# Altium schematic sheet S7CAS-PLEIADES-CARTE-MERE_TO_BE_DELETED.SchDoc
size Tabloid; SheetNumber: 18; SheetTotal: 18; Size: 11x17; Sheet_Name: Sheet Description
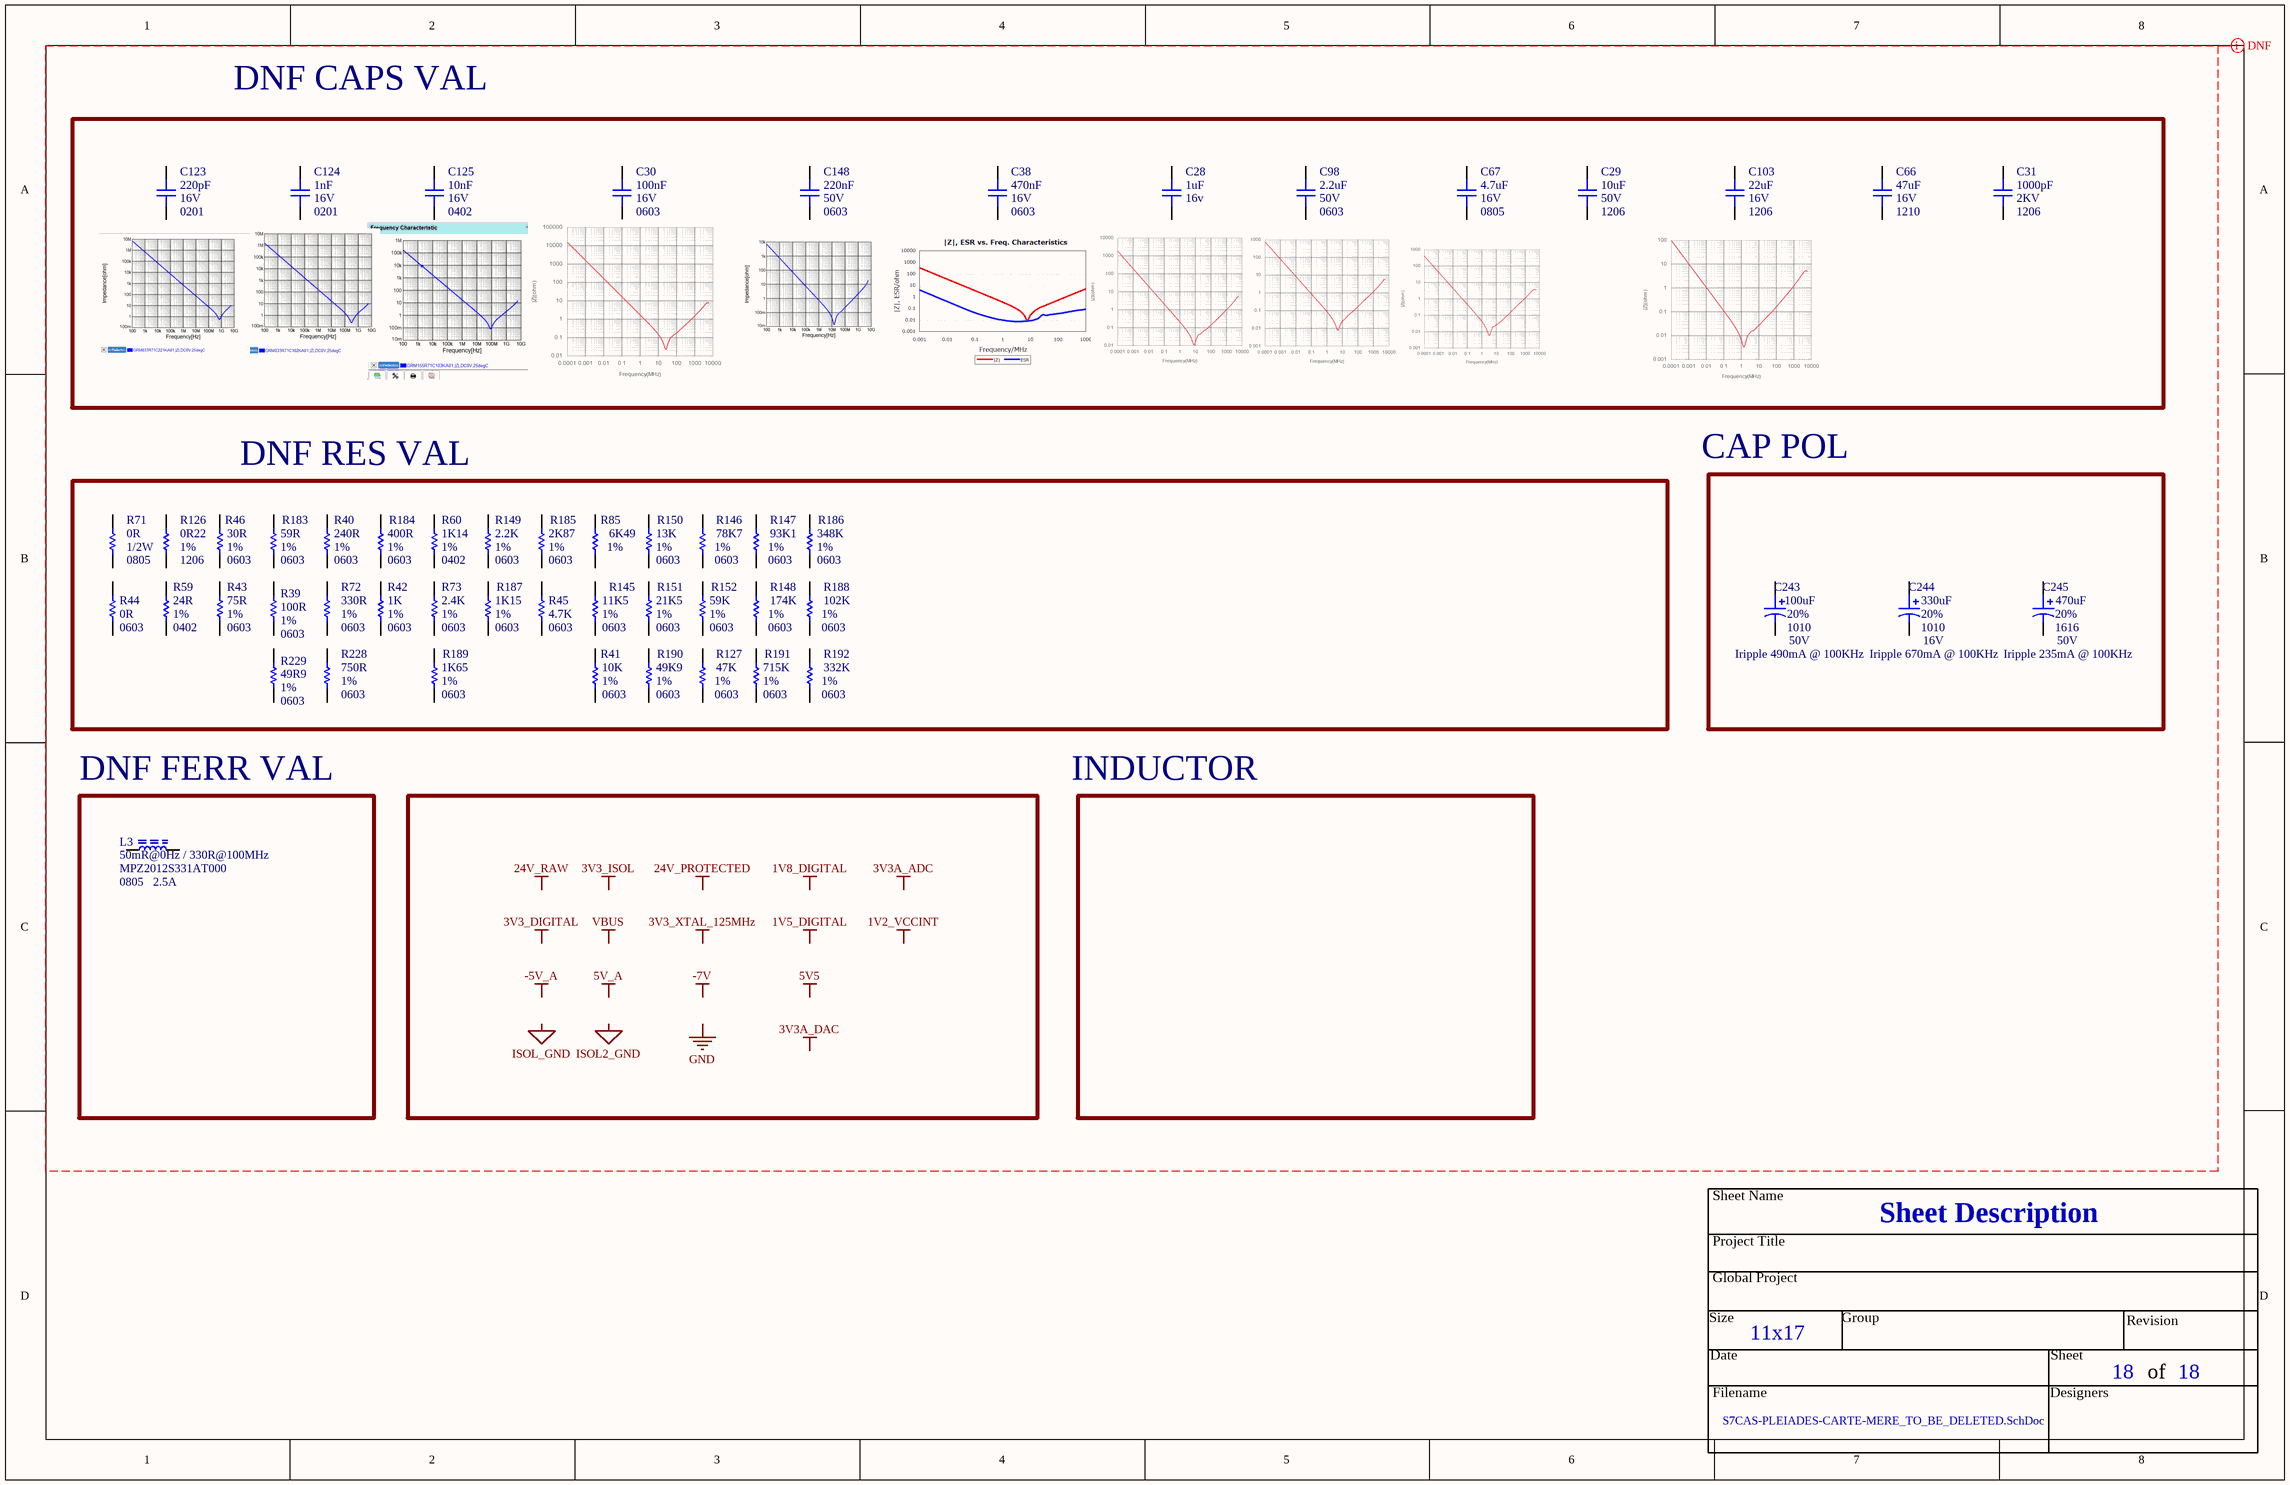
[diagram p0: S7CAS-PLEIADES-CARTE-MERE_TO_BE_DELETED.SchDoc]

## Parts
C28  value 1uF  Voltage: 16v  [CAP_0603]  (hidden comment: CAP - 0603)
C29  value 10uF  Voltage: 50V  Package: 1206  [CAP_1206]  (hidden comment: CAP - 1206)
C30  value 100nF  Voltage: 16V  Package: 0603  [CAP_0603]  (hidden comment: CAP - 0603)
C31  value 1000pF  Voltage: 2KV  Package: 1206  [CAP_1206]  (hidden comment: CAP - 1206)
C38  value 470nF  Voltage: 16V  Package: 0603  [CAP_0603]  (hidden comment: CAP - 0603)
C66  value 47uF  Voltage: 16V  Package: 1210  [CAP_1210]  (hidden comment: CAP - 1210)
C67  value 4.7uF  Voltage: 16V  Package: 0805  [CAP_0805]  (hidden comment: CAP - 0805)
C98  value 2.2uF  Voltage: 50V  Package: 0603  [CAP_0603]  (hidden comment: CAP - 0603)
C103  value 22uF  Voltage: 16V  Package: 1206  [CAP_1206]  (hidden comment: CAP - 1206)
C123  value 220pF  Voltage: 16V  Package: 0201  [CAP_0201]  (hidden comment: CAP - 0201)
C124  value 1nF  Voltage: 16V  Package: 0201  [CAP_0201]  (hidden comment: CAP - 0201)
C125  value 10nF  Voltage: 16V  Package: 0402  [CAP_0402]  (hidden comment: CAP - 0402)
C148  value 220nF  Voltage: 50V  Package: 0603  [CAP_0603]  (hidden comment: CAP - 0603)
C243  value 100uF  Voltage: 50V  Package: 1010  Precision: 20%  [CAP_ALU_1010_vishay]  (hidden comment: MAL215099101E3)
C244  value 330uF  Voltage: 16V  Package: 1010  Precision: 20%  [CAP_ALU_1010_vishay]  (hidden comment: MAL214699501E3)
C245  value 470uF  Voltage: 50V  Package: 1616  Precision: 20%  [CAP_ALU_1616_vishay]  (hidden comment: MAL214699108E3)
L3  value 50mR@0Hz / 330R@100MHz  Mfg Part Number: MPZ2012S331AT000  Current: 2.5A  Package: 0805  [FER_0805]  (hidden comment: FER - 0805)
R39  value 100R  Package: 0603  Precision: 1%  [RES_0603]  (hidden comment: RES - 0603)
R40  value 240R  Package: 0603  Precision: 1%  [RES_0603]  (hidden comment: RES - 0603)
R41  value 10K  Package: 0603  Precision: 1%  [RES_0603]  (hidden comment: RES - 0603)
R42  value 1K  Package: 0603  Precision: 1%  [RES_0603]  (hidden comment: RES - 0603)
R43  value 75R  Package: 0603  Precision: 1%  [RES_0603]  (hidden comment: RES - 0603)
R44  value 0R  Package: 0603  [RES_0603]  (hidden comment: RES - 0603)
R45  value 4.7K  Package: 0603  [RES_0603]  (hidden comment: RES - 0603)
R46  value 30R  Package: 0603  Precision: 1%  [RES_0603]  (hidden comment: RES - 0603)
R59  value 24R  Package: 0402  Precision: 1%  [RES_0402]  (hidden comment: RES - 0402)
R60  value 1K14  Package: 0402  Precision: 1%  [RES_0402]  (hidden comment: RES - 0402)
R71  value 0R  Power: 1/2W  Package: 0805  [RES_0805]  (hidden comment: RES - 0805)
R72  value 330R  Package: 0603  Precision: 1%  [RES_0603]  (hidden comment: RES - 0603)
R73  value 2.4K  Package: 0603  Precision: 1%  [RES_0603]  (hidden comment: RES - 0603)
R85  value 6K49  Precision: 1%  [RES_0402]  (hidden comment: RES - 0402)
R126  value 0R22  Package: 1206  Precision: 1%  [RES_1206]  (hidden comment: RES - 1206)
R127  value 47K  Package: 0603  Precision: 1%  [RES_0603]  (hidden comment: RES - 0603)
R145  value 11K5  Package: 0603  Precision: 1%  [RES_0603]  (hidden comment: RES - 0603)
R146  value 78K7  Package: 0603  Precision: 1%  [RES_0603]  (hidden comment: RES - 0603)
R147  value 93K1  Package: 0603  Precision: 1%  [RES_0603]  (hidden comment: RES - 0603)
R148  value 174K  Package: 0603  Precision: 1%  [RES_0603]  (hidden comment: RES - 0603)
R149  value 2.2K  Package: 0603  Precision: 1%  [RES_0603]  (hidden comment: RES - 0603)
R150  value 13K  Package: 0603  Precision: 1%  [RES_0603]  (hidden comment: RES - 0603)
R151  value 21K5  Package: 0603  Precision: 1%  [RES_0603]  (hidden comment: RES - 0603)
R152  value 59K  Package: 0603  Precision: 1%  [RES_0603]  (hidden comment: RES - 0603)
R183  value 59R  Package: 0603  Precision: 1%  [RES_0603]  (hidden comment: RES - 0603)
R184  value 400R  Package: 0603  Precision: 1%  [RES_0603]  (hidden comment: RES - 0603)
R185  value 2K87  Package: 0603  Precision: 1%  [RES_0603]  (hidden comment: RES - 0603)
R186  value 348K  Package: 0603  Precision: 1%  [RES_0603]  (hidden comment: RES - 0603)
R187  value 1K15  Package: 0603  Precision: 1%  [RES_0603]  (hidden comment: RES - 0603)
R188  value 102K  Package: 0603  Precision: 1%  [RES_0603]  (hidden comment: RES - 0603)
R189  value 1K65  Package: 0603  Precision: 1%  [RES_0603]  (hidden comment: RES - 0603)
R190  value 49K9  Package: 0603  Precision: 1%  [RES_0603]  (hidden comment: RES - 0603)
R191  value 715K  Package: 0603  Precision: 1%  [RES_0603]  (hidden comment: RES - 0603)
R192  value 332K  Package: 0603  Precision: 1%  [RES_0603]  (hidden comment: RES - 0603)
R228  value 750R  Package: 0603  Precision: 1%  [RES_0603]  (hidden comment: RES - 0603)
R229  value 49R9  Package: 0603  Precision: 1%  [RES_0603]  (hidden comment: RES - 0603)

## Blocks framed on the sheet
DNF RES VAL: R39-R46 R59 R60 R71-R73 R85 R126 R127 R145-R152 R183-R192 R228 R229
DNF FERR VAL: L3

## Nets

Not connected (* = marked no-connect by the designer): C28 1 2; C29 1 2; C30 1 2; C31 1 2; C38 1 2; C66 1 2; C67 1 2; C98 1 2; C103 1 2; C123 1 2; C124 1 2; C125 1 2; C148 1 2; C243 1 2; C244 1 2; C245 1 2; L3 1 2; R39 1 2; R40 1 2; R41 1 2; R42 1 2; R43 1 2; R44 1 2; R45 1 2; R46 1 2; R59 1 2; R60 1 2; R71 1 2; R72 1 2; R73 1 2; R85 1 2; R126 1 2; R127 1 2; R145 1 2; R146 1 2; R147 1 2; R148 1 2; R149 1 2; R150 1 2; R151 1 2; R152 1 2; R183 1 2; R184 1 2; R185 1 2; R186 1 2; R187 1 2; R188 1 2; R189 1 2; R190 1 2; R191 1 2; R192 1 2; R228 1 2; R229 1 2

## Layout directives
CompClassName: DNF_CLASS_COMPONENT: 1V2_VCCINT, 1V5_DIGITAL, 1V8_DIGITAL, 3V3_DIGITAL, 3V3_ISOL, 3V3_XTAL_125MHz, 3V3A_ADC, 3V3A_DAC, 5V5, 5V_A, 24V_PROTECTED, 24V_RAW, -5V_A, -7V, GND, ISOL2_GND, ISOL_GND, VBUS

## Notes on the sheet
- DNF CAPS VAL
- CAP POL
- (near C243) Iripple 490mA @ 100KHz
- (near C244) Iripple 670mA @ 100KHz
- (near C245) Iripple 235mA @ 100KHz
- INDUCTOR
- Labels drawn without touching a wire or pin: 1V2_VCCINT, 1V5_DIGITAL, 1V8_DIGITAL, 3V3_DIGITAL, 3V3_ISOL, 3V3_XTAL_125MHz, 3V3A_ADC, 3V3A_DAC, 5V5, 5V_A, 24V_PROTECTED, 24V_RAW, -5V_A, -7V, GND, ISOL2_GND, ISOL_GND, VBUS
- Sheet Name
- Project Title
- Global Project
- Revision
- Size
- Date
- Group
- Sheet
- of
- Filename
- Designers

## Library data of the parts
C28 C30 C38 C98 C148 = CAP - 0603: Precision: 10%; Current: *; CreatedBy: Jonathan Bouchard; Power: *; Supplier 1: Arrow Electronics
  C28: Package: 0603; Supplier Part Number 1: CL10B105MO8NNWC
  C30: Supplier Part Number 1: CL10B104KO8NNNC
  C38: Supplier Part Number 1: C1608X7R1C474K080AC
  C98: Supplier Part Number 1: GRM188R61H225KE11D
  C148: Supplier Part Number 1: GRM188R71H224KAC4D
C29 C31 C103 = CAP - 1206: Precision: 10%; Current: *; CreatedBy: Jonathan Bouchard; Power: *
  C29: Supplier 1: Avnet; Supplier Part Number 1: CL31A106MBHNNNE
  C31: Supplier 1: Arrow Electronics; Supplier Part Number 1: 1206GC102KAT1A
  C103: Supplier 1: Arrow Electronics; Supplier Part Number 1: CL31A226MOCLNNC
C66 = CAP - 1210: Precision: 10%; Current: *; CreatedBy: Jonathan Bouchard; Power: *; Supplier 1: Arrow Electronics; Supplier Part Number 1: CL32A476KOJNNNE
C67 = CAP - 0805: Precision: 10%; Current: *; CreatedBy: Jonathan Bouchard; Power: *; Supplier 1: Arrow Electronics; Supplier Part Number 1: CL21B475KOFNFNE
C123 C124 = CAP - 0201: Precision: 10%; Current: *; CreatedBy: Jonathan Bouchard; Power: *
  C123: Supplier 1: Arrow Electronics; Supplier Part Number 1: GRM033R71C221KA01D
  C124: Supplier 1: Avnet; Supplier Part Number 1: GRM033R71C102KA01J
C125 = CAP - 0402: Precision: 10%; Current: *; CreatedBy: Jonathan Bouchard; Power: *; Supplier 1: Arrow Electronics; Supplier Part Number 1: GRM155R61A224KE19D
C243 = CAP_ALU_MAL215099101E3: CAP - ALU 100uF 20% 50V - 1010; Current: 490mA; Mfg: Vishay Dale; Mfg Part Number: MAL215099101E3; HelpURL: http://www.vishay.com/docs/28395/150crz.pdf; CreatedBy: Jonathan Bouchard; Temperature: -55°C to 125°C; Power: *; Supplier 1: Digikey; Supplier Part Number 1: 4399PHDKR-ND
C244 = CAP_ALU_MAL214699501E3: CAP - ALU 330uF 20% 16V - 1010; Current: 750mA; Mfg: Vishay Dale; Mfg Part Number: MAL214699501E3; HelpURL: http://www.vishay.com/docs/28403/146cti.pdf; CreatedBy: Jonathan Bouchard; Temperature: -55°C to 125°C; Power: *; Supplier 1: Digikey; Supplier Part Number 1: 4405PHCT-ND
C245 = CAP_ALU_MAL214699108E3: CAP - ALU 470uF 20% 50V - 1616; Current: 1.3A; Mfg: Vishay Dale; Mfg Part Number: MAL214699108E3; HelpURL: http://www.vishay.com/docs/28403/146cti.pdf; CreatedBy: Jonathan Bouchard; Temperature: -55°C to 125°C; Power: *; Supplier 1: Digikey; Supplier Part Number 1: 4442PHCT-ND
L3 = FER - 0805: Mfg: TDK Corporation; Voltage: *; CreatedBy: Jonathan Bouchard; Power: *; Precision: *; Supplier 1: Arrow Electronics; Supplier Part Number 1: MPZ2012S331AT000
R44 R45 = RES - 0603: Precision: 1%; Current: *; CreatedBy: Jonathan Bouchard; Supplier 1: Arrow Electronics
  R44: Supplier Part Number 1: RMCF0603ZT0R00
  R45: Supplier Part Number 1: RMCF0603FT4K70
R59 R60 R85 = RES - 0402: Voltage: 50V; Power: 1/16W; Current: *; CreatedBy: Jonathan Bouchard
  R59: Supplier 1: Arrow Electronics; Supplier Part Number 1: RC0402FR-0724RL
  R60: Supplier 1: Digikey; Supplier Part Number 1: 2019-RN73H1ETTP1141F50CT-ND
  R85: Package: 0402; Supplier 1: Mouser; Supplier Part Number 1: 652-CR0402-FX6491GLF
R71 = RES - 0805: Precision: 1%; Current: *; CreatedBy: Jonathan Bouchard; Supplier 1: Arrow Electronics; Supplier Part Number 1: HCJ0805ZT0R00
R39-R43 R46 R72 R73 R127 R145-R152 R183-R192 R228 R229 = RES - 0603: Current: *; CreatedBy: Jonathan Bouchard
  R39: Supplier 1: Arrow Electronics; Supplier Part Number 1: RMCF0603FT100R
  R40: Supplier 1: Arrow Electronics; Supplier Part Number 1: RMCF0603FT240R
  R41: Supplier 1: Arrow Electronics; Supplier Part Number 1: RMCF0603FT10K0
  R42: Supplier 1: Arrow Electronics; Supplier Part Number 1: RMCF0603FT1K00
  R43: Supplier 1: Arrow Electronics; Supplier Part Number 1: RMCF0603FT75R0
  R46: Supplier 1: Arrow Electronics; Supplier Part Number 1: RMCF0603FT30R0
  R72: Supplier 1: Arrow Electronics; Supplier Part Number 1: RMCF0603FT330R
  R73: Supplier 1: Mouser; Supplier Part Number 1: 603-RC0603FR-132K4L
  R127: Supplier 1: Arrow Electronics; Supplier Part Number 1: RMCF0603FT47K0
  R145: Supplier 1: Arrow Electronics; Supplier Part Number 1: RMCF0603FT11K5
  R146: Supplier 1: Arrow Electronics; Supplier Part Number 1: RMCF0603FT78K7
  R147: Supplier 1: Arrow Electronics; Supplier Part Number 1: RMCF0603FT93K1
  R148: Supplier 1: Arrow Electronics; Supplier Part Number 1: RMCF0603FT174K
  R149: Supplier 1: Newark; Supplier Part Number 1: 94X1502
  R150: Supplier 1: Arrow Electronics; Supplier Part Number 1: RMCF0603FT13K0
  R151: Supplier 1: Arrow Electronics; Supplier Part Number 1: RMCF0603FT21K5
  R152: Supplier 1: Arrow Electronics; Supplier Part Number 1: RMCF0603FT59K0
  R183: Supplier 1: Digikey; Supplier Part Number 1: 738-RMCF0603FT59R0CT-ND
  R184: Supplier 1: Mouser; Supplier Part Number 1: 71-PAT0603E4000BST1
  R185: Supplier 1: Arrow Electronics; Supplier Part Number 1: RMCF0603FT2K87
  R186: Supplier 1: Arrow Electronics; Supplier Part Number 1: RMCF0603FT348K
  R187: Supplier 1: Arrow Electronics; Supplier Part Number 1: RMCF0603FT1K15
  R188: Supplier 1: Arrow Electronics; Supplier Part Number 1: RMCF0603FT102K
  R189: Supplier 1: Arrow Electronics; Supplier Part Number 1: RMCF0603FT1K65
  R190: Supplier 1: Digikey; Supplier Part Number 1: RMCF0603FG49K9CT-ND
  R191: Supplier 1: Digikey; Supplier Part Number 1: 738-RMCF0603FT715KCT-ND
  R192: Supplier 1: Arrow Electronics; Supplier Part Number 1: RMCF0603FT332K
  R228: Supplier 1: Arrow Electronics; Supplier Part Number 1: RMCF0603FT750R
  R229: Supplier 1: Mouser; Supplier Part Number 1: 667-ERJ-3EKF49R9V
R126 = RES - 1206: Current: *; CreatedBy: Jonathan Bouchard; Supplier 1: Mouser; Supplier Part Number 1: 667-ERJ-8RQFR22V